# EAGLE design main_board (EAGLE 7.5.0)
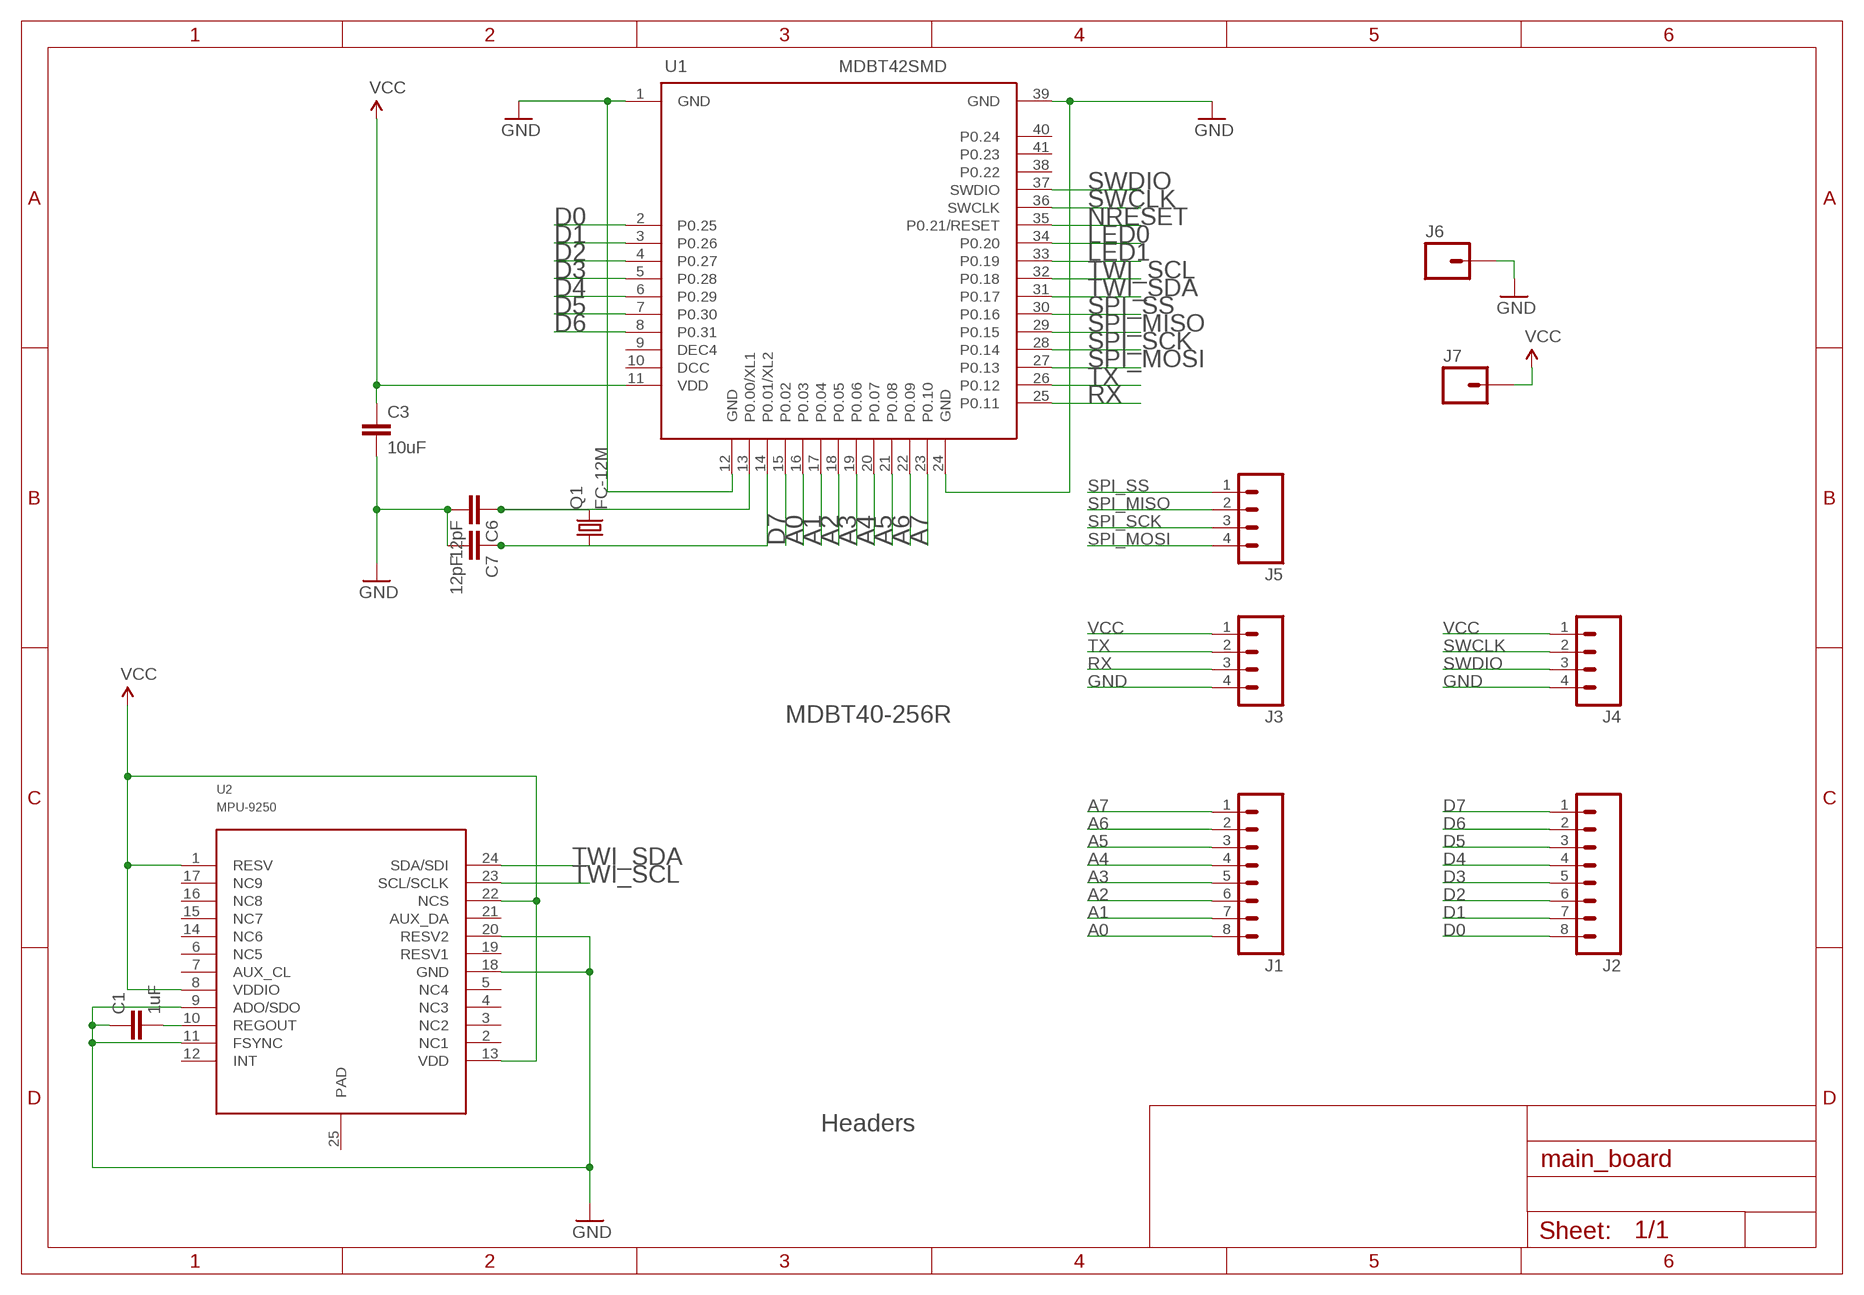
[diagram p0: schematic, sheet 1]

## Parts
C1  1uF  CAP0603-CAP  [0603-CAP]
C3  10uF  CAP0603-CAP  [0603-CAP]
C6  12pF  CAP0603-CAP  [0603-CAP]
C7  12pF  CAP0603-CAP  [0603-CAP]
J1  M08SILK_FEMALE_PTH  [1X08]
J2  M08SILK_FEMALE_PTH  [1X08]
J3  M04PTH  [1X04]
J4  M04PTH  [1X04]
J5  M04PTH  [1X04]
J6  M01_SMDSMD_4X2  [1X01_SMD]
J7  M01_SMDSMD_4X2  [1X01_SMD]
Q1  FC-12M  [FC-12M]
U1  MDBT42SMD  [MDBT42]
U2  MPU-9250  [LEAD-QFN24]

## Nets
A0: J1.8 U1.16(P0.03)
A1: J1.7 U1.17(P0.04)
A2: J1.6 U1.18(P0.05)
A3: J1.5 U1.19(P0.06)
A4: J1.4 U1.20(P0.07)
A5: J1.3 U1.21(P0.08)
A6: J1.2 U1.22(P0.09)
A7: J1.1 U1.23(P0.10)
D0: J2.8 U1.2(P0.25)
D1: J2.7 U1.3(P0.26)
D2: J2.6 U1.4(P0.27)
D3: J2.5 U1.5(P0.28)
D4: J2.4 U1.6(P0.29)
D5: J2.3 U1.7(P0.30)
D6: J2.2 U1.8(P0.31)
D7: J2.1 U1.15(P0.02)
GND: C1.1 C3.2 C6.2 C7.2 J3.4 J4.4 J6.P$1 U1.1(GND) U1.12(GND) U1.24(GND) U1.39(GND) U2.9(ADO/SDO) U2.11(FSYNC) U2.18(GND) U2.20(RESV2)
LED0: U1.34(P0.20)
LED1: U1.33(P0.19)
N$2: C7.1 Q1.1 U1.14(P0.01/XL2)
N$3: C6.1 Q1.2 U1.13(P0.00/XL1)
N$5: C1.2 U2.10(REGOUT)
NRESET: U1.35(P0.21/RESET)
RX: J3.3 U1.25(P0.11)
SPI_MISO: J5.2 U1.29(P0.15)
SPI_MOSI: J5.4 U1.27(P0.13)
SPI_SCK: J5.3 U1.28(P0.14)
SPI_SS: J5.1 U1.30(P0.16)
SWCLK: J4.2 U1.36(SWCLK)
SWDIO: J4.3 U1.37(SWDIO)
TWI_SCL: U1.32(P0.18) U2.23(SCL/SCLK)
TWI_SDA: U1.31(P0.17) U2.24(SDA/SDI)
TX: J3.2 U1.26(P0.12)
VCC: C3.1 J3.1 J4.1 J7.P$1 U1.11(VDD) U2.1(RESV) U2.8(VDDIO) U2.13(VDD) U2.22(NCS)
Unconnected: U1.9(DEC4) U1.10(DCC) U1.38(P0.22) U1.40(P0.24) U1.41(P0.23) U2.2(NC1) U2.3(NC2) U2.4(NC3) U2.5(NC4) U2.6(NC5) U2.7(AUX_CL) U2.12(INT) U2.14(NC6) U2.15(NC7) U2.16(NC8) U2.17(NC9) U2.19(RESV1) U2.21(AUX_DA) U2.25(PAD)

## Notes on the sheet
- MDBT40-256R
- Headers

## Library data of the parts
C1 C3 C6 C7 = SparkFun-Capacitors:CAP: Capacitor Standard 0603 ceramic capacitor, and 0.1" leaded capacitor.
J1 J2 = SparkFun-Connectors_2:M08: Header 8 Standard 8-pin 0.1" header. Use with straight break away headers (SKU : PRT-00116), right angle break away headers (PRT-00553), swiss pins (PRT-00743), machine pins (PRT-00117), and female headers (PRT-00115).; PROD_ID: CONN-08438
J3-J5 = SparkFun-Connectors_2:M04: Header 4 Standard 4-pin 0.1" header. Use with straight break away headers (SKU : PRT-00116), right angle break away headers (PRT-00553), swiss pins (PRT-00743), machine pins (PRT-00117), and female headers (PRT-00115). Molex polarized connector foot print use with SKU : PRT-08231 with associated crimp pins and housings. 1MM SMD Version SKU: PRT-10208; PROD_ID: CONN-09696
J6 J7 = SparkFun-Connectors 2:M01_SMD: Header 1 Standard 1-pin 0.1" header. Use with straight break away headers (SKU : PRT-00116), right angle break away headers (PRT-00553), swiss pins (PRT-00743), machine pins (PRT-00117), and female headers (PRT-00115). SMTSO-256-ET is a "flush mount" nut for a 4-40 screw. The older package used to be too tight, and did not allow it to sit properly thru the drill hit. The latest (0.165DIA) fits nice and snug.
Q1 = crystal:FC-12M: kHz RANGE CRYSTAL UNIT LOW PROFILE SMD Source: Epson Toyocom FC-12M.pdf
U1 = MDBT42:MDBT42
U2 = invensense:MPU-9250

## Board
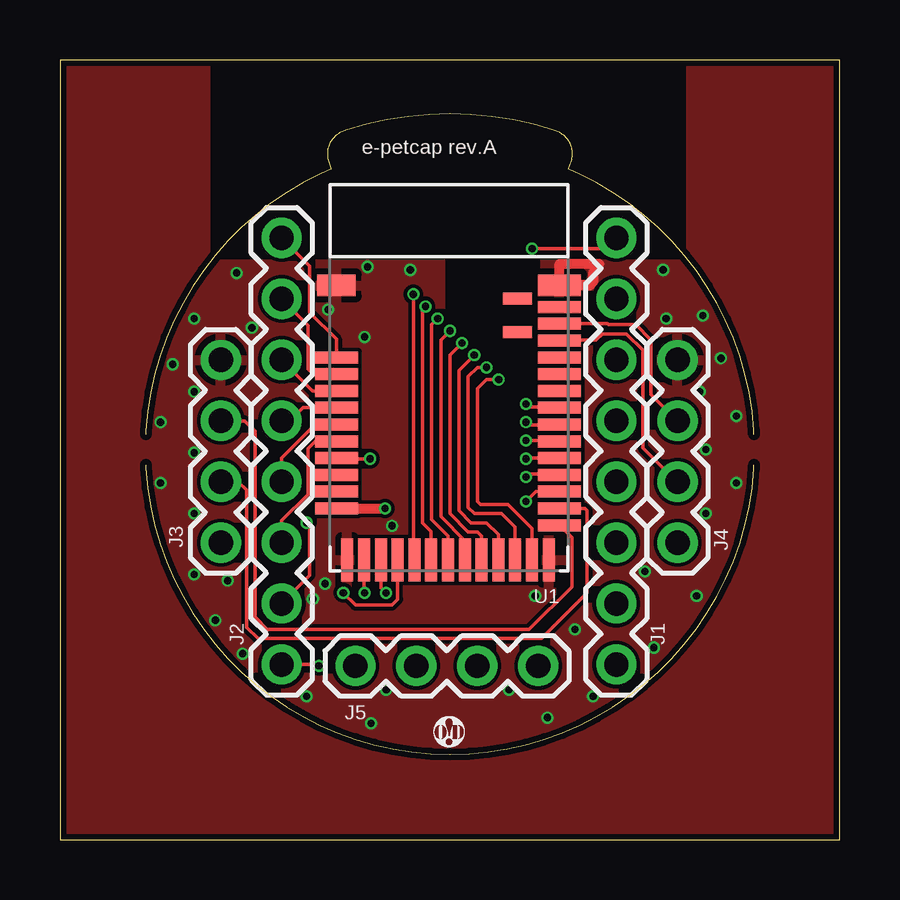
[diagram p1: board, top side]
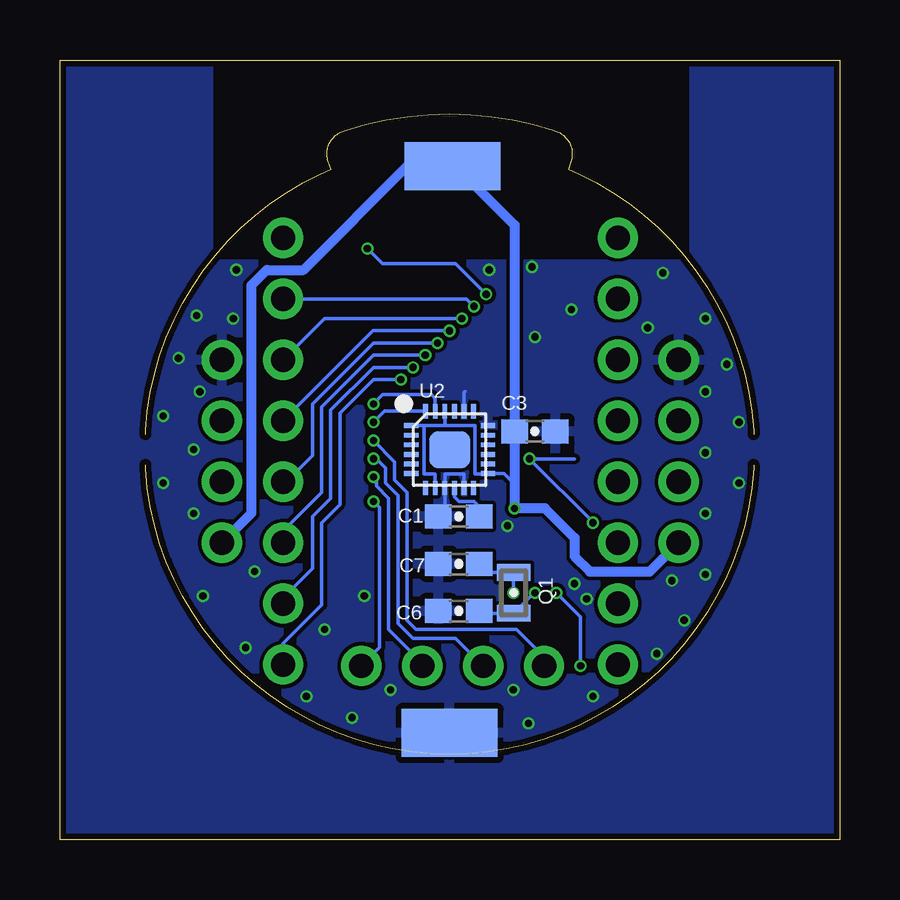
[diagram p2: board, bottom side, seen from below]

Size 32.5 x 32.5 mm. Coordinates in mm from the lower left corner, seen from the top.
Outline: 3.58,16.89 3.58,17.05 3.66,17.85 3.78,18.64 3.96,19.41 4.18,20.18 4.45,20.93 4.76,21.66 5.13,22.37 5.53,23.06 5.98,23.72 6.47,24.35 7,24.95 7.56,25.51 8.16,26.04 8.79,26.53 9.45,26.98 10.14,27.39 10.85,27.75 11.31,27.95 11.2,28.28 11.18,28.34 11.16,28.4 11.15,28.46 11.15,28.52 11.15,28.59 11.15,28.65 11.15,28.71 11.16,28.77 11.18,28.84 11.2,28.89 11.22,28.95 11.24,29.01 11.27,29.07 11.3,29.12 11.34,29.17 11.38,29.22 11.42,29.27 11.46,29.32 11.51,29.36 11.56,29.39 11.61,29.43 11.66,29.46 11.72,29.49 11.78,29.52 11.93,29.57 12.77,29.82 13.63,30.01 14.5,30.15 15.38,30.23 16.26,30.26 17.14,30.23 18.01,30.15 18.88,30.01 19.74,29.82 20.58,29.57 20.73,29.52 20.79,29.49 20.85,29.46 20.9,29.43 20.95,29.39 21,29.36 21.05,29.32 21.09,29.27 21.14,29.22 21.18,29.17 21.21,29.12 21.24,29.07 21.27,29.01 21.3,28.95 21.32,28.89 21.34,28.84 21.35,28.77 21.36,28.71 21.36,28.65 21.37,28.59 21.36,28.52 21.36,28.46 21.35,28.4 21.34,28.34 21.32,28.28 21.21,27.95 21.66,27.75 22.37,27.39 23.06,26.98 23.72,26.53 24.35,26.04 24.95,25.51 25.51,24.95 26.04,24.35 26.53,23.72 26.98,23.06 27.39,22.37 27.75,21.66 28.06,20.93 28.33,20.18 28.56,19.41 28.73,18.64 28.86,17.85 28.93,17.05 28.94,16.89
Outline: 28.94,15.62 28.93,15.46 28.86,14.66 28.73,13.88 28.56,13.1 28.33,12.33 28.06,11.58 27.75,10.85 27.39,10.14 26.98,9.45 26.53,8.79 26.04,8.16 25.51,7.56 24.95,7 24.35,6.47 23.72,5.98 23.06,5.53 22.37,5.13 21.66,4.76 20.93,4.45 20.18,4.18 19.41,3.96 18.64,3.78 17.85,3.66 17.05,3.58 16.26,3.56 15.46,3.58 14.66,3.66 13.88,3.78 13.1,3.96 12.33,4.18 11.58,4.45 10.85,4.76 10.14,5.13 9.45,5.53 8.79,5.98 8.16,6.47 7.56,7 7,7.56 6.47,8.16 5.98,8.79 5.53,9.45 5.13,10.14 4.76,10.85 4.45,11.58 4.18,12.33 3.96,13.1 3.78,13.88 3.66,14.66 3.58,15.46 3.58,15.62
Outline: 0,0 32.5,0 32.5,32.5 0,32.5 0,0
Copper layers (1*2*15*16): Top 0.035mm / dielectric 0.2mm / Route2 0.0175mm / dielectric 0.3mm / Route15 0.0175mm / dielectric 0.2mm / Bottom 0.035mm
Design rules "SeeedStudio_4layer_DRU_no_angle_20140221 *": minimum track width 6mil, minimum drill 0.29971875mm, track to track 6mil, track to pad 6mil, pad to pad 6mil, via to via 6mil, smd to smd 0mil, copper to edge 10mil, drill to drill 8mil, minimum pad ring 6mil, minimum via ring 4mil, stop-mask expansion 4mil, vias tented up to drill 25mil, thermal gap 10mil
tRestrict: area 6.3,20.2 to 26,32.5
bRestrict: area 6.3,24.3 to 26,32.5

### Footprints (pad centres in the part's own frame; a part is rotated, then mirrored left to right if it is on the bottom)
0603-CAP = smd 1.1 x 1: 1 -0.85,0; 2 0.85,0
1X08 = drill 1.016 pad 1.676: 1 0,0; 2 2.54,0; 3 5.08,0; 4 7.62,0; 5 10.16,0; 6 12.7,0; 7 15.24,0; 8 17.78,0
1X04 = drill 1.016 pad 1.676: 1 0,0; 2 2.54,0; 3 5.08,0; 4 7.62,0
1X01_SMD = smd 4 x 2: P$1 0,0
FC-12M = smd 0.7 x 1.4: 1 -0.85,0; 2 0.85,0
MDBT42 = smd 1.6 x 0.9: 1 0.35,11.8 | smd 1.8 x 0.5: 2 0.35,8.8; 3 0.35,8.1; 4 0.35,7.4; 5 0.35,6.7; 6 0.35,6; 7 0.35,5.3; 8 0.35,4.6; 9 0.35,3.9; 10 0.35,3.2; 11 0.35,2.5; 25 9.65,1.8; 26 9.65,2.5; 27 9.65,3.2; 28 9.65,3.9; 29 9.65,4.6; 30 9.65,5.3; 31 9.65,6; 32 9.65,6.7; 33 9.65,7.4; 34 9.65,8.1; 35 9.65,8.8; 36 9.65,9.5; 37 9.65,10.2; 38 9.65,10.9 | smd 0.5 x 1.8: 12 0.8,0.35; 13 1.5,0.35; 14 2.2,0.35; 15 2.9,0.35; 16 3.6,0.35; 17 4.3,0.35; 18 5,0.35; 19 5.7,0.35; 20 6.4,0.35; 21 7.1,0.35; 22 7.8,0.35; 23 8.5,0.35; 24 9.2,0.35 | smd 1.8 x 0.9: 39 9.65,11.8 | smd 1.2 x 0.5: 40 7.9,11.25; 41 7.9,9.85
LEAD-QFN24 = smd 0.6 x 0.2: 1 -1.6,1; 2 -1.6,0.6; 3 -1.6,0.2; 4 -1.6,-0.2; 5 -1.6,-0.6; 6 -1.6,-1; 13 1.6,-1; 14 1.6,-0.6; 15 1.6,-0.2; 16 1.6,0.2; 17 1.6,0.6; 18 1.6,1 | smd 0.2 x 0.6: 7 -1,-1.6; 8 -0.6,-1.6; 9 -0.2,-1.6; 10 0.2,-1.6; 11 0.6,-1.6; 12 1,-1.6; 19 1,1.6; 20 0.6,1.6; 21 0.2,1.6; 22 -0.2,1.6; 23 -0.6,1.6; 24 -1,1.6 | smd 1.7 x 1.54: 25 0,0

### Placement (x,y rotation side)
C1  15.88,13.46 0 bottom
C3  12.7,17.02 0 bottom
C6  15.88,9.53 180 bottom
C7  15.88,11.49 180 bottom
J1  23.2,7.3 90 top
J2  9.24,7.3 90 top
J3  6.71,12.37 90 top
J4  25.75,12.37 90 top
J5  12.32,7.24 0 top
J6  16.26,4.45 0 bottom
J7  16.13,28.07 0 bottom
Q1  13.59,10.29 270 bottom
U1  11.18,11.3 0 top
U2  16.26,16.26 0 bottom

### Tracks (layer width: path | path; a pad name or v marks a point on that pad's centre or on a via)
A0  (via drill 0.3)
  Top 0.152: v14.73,22.73 14.73,11.7 U1.16 | J1.8 22.76,24.64 v19.68,24.64
  Bottom 0.152: v14.73,22.73 16,24 19.05,24 v19.68,24.64
A1  (via drill 0.3)
  Top 0.152: v15.24,22.23 15.11,22.1 15.11,13.21 15.48,12.85 U1.17
  Bottom 0.152: v15.24,22.23 15.55,22.54 J1.7
A2  (via drill 0.3)
  Top 0.152: v15.75,21.72 15.49,21.46 15.49,13.34 16.18,12.65 U1.18
  Bottom 0.152: v15.75,21.72 21.48,21.72 J1.6
A3  (via drill 0.3)
  Top 0.152: v16.26,21.21 15.88,20.83 15.88,13.46 16.89,12.45 16.89,11.67 U1.19
  Bottom 0.152: v16.26,21.21 19.45,21.21 J1.5
A4  (via drill 0.3)
  Top 0.152: 17.53,11.7 U1.20 17.58,12.65 17.4,12.83 17.02,12.83 16.26,13.59 16.26,20.19 v16.76,20.7
  Bottom 0.152: v16.76,20.7 19.43,20.7 21.97,18.16 21.97,16 23.05,14.92 J1.4
A5  (via drill 0.3)
  Top 0.152: 18.29,11.66 U1.21 18.28,12.71 17.78,13.21 17.14,13.21 16.64,13.72 16.64,19.56 v17.27,20.19
  Bottom 0.152: v17.27,20.19 19.43,20.19 21.59,18.03 21.59,14.48 23.2,12.87 J1.3
A6  (via drill 0.3)
  Top 0.152: 18.92,11.71 U1.22 18.98,13.03 18.41,13.59 17.27,13.59 17.02,13.84 17.02,19.3 17.4,19.68 v17.78,19.68
  Bottom 0.152: v17.78,19.68 19.43,19.68 21.21,17.91 21.21,14.22 21.97,13.46 21.97,11.3 23.2,10.08 J1.2
A7  (via drill 0.3)
  Top 0.152: 19.56,11.77 U1.23 19.68,12.96 18.67,13.97 17.53,13.97 17.4,14.1 17.4,18.8 17.78,19.18 v18.29,19.18
  Bottom 0.152: v18.29,19.18 19.43,19.18 20.83,17.78 20.83,13.97 21.59,13.21 21.59,9.78 23.2,8.17 J1.1
D0
  Top 0.152: J2.8 10.41,23.91 10.41,21.97 11.53,20.86 U1.2
D1
  Top 0.152: J2.7 10.35,21.42 10.35,19.61 10.57,19.4 U1.3
D2
  Top 0.152: J2.6 10.54,18.7 U1.4
D3
  Top 0.152: J2.5 9.59,17.46 10.13,18 U1.5
D4
  Top 0.152: J2.4 9.24,15.9 10.6,17.27 11.49,17.27 U1.6
D5
  Top 0.152: J2.3 9.24,13.3 10.35,14.39 10.35,16.29 10.63,16.6 U1.7
D6  (via drill 0.3)
  Top 0.152: v12.93,15.88 11.53,15.88 U1.8 | J2.2 10.41,11.01 10.41,13.08 v10.29,13.21
  Bottom 0.152: 11.05,15.88 v12.93,15.88 10.29,13.23 v10.29,13.21
D7  (via drill 0.3)
  Top 0.152: J2.1 10.73,7.3 v10.79,7.24 | U1.15 14.08,10.01 13.84,9.78 12.32,9.78 v11.81,10.29
  Bottom 0.152: v10.79,7.24 10.79,9.27 v11.81,10.29
GND  (via drill 0.3)
  Top 0.406: U1.39 20.83,23.11 | 20.83,23.11 20.83,24 22.48,24 22.23,23.62 22.23,23.24 22.1,23.11 20.83,23.11
  Bottom 0.152: U2.11 15.66,15.24 16.46,15.24 U2.9 16.46,13.34 C1.1 | U2.20 15.66,18.63 15.62,18.67
  other vias: 10.29,5.97 7.62,7.75 6.48,9.14 5.59,11.05 6.99,10.79 5.59,13.59 5.59,16.13 5.59,18.67 5.59,21.72 7.37,23.62 8,21.34 12.7,20.95 12.83,23.88 11.18,22.1 14.61,23.75 25.27,21.72 25.15,23.75 26.8,21.84 28.19,17.65 26.92,16.26 26.92,13.59 26.54,10.16 28.19,14.86 26.67,18.67 4.7,19.81 4.19,17.4 4.19,14.86 27.56,20.07 20.32,5.08 19.81,10.16 10.54,10.03 11.05,10.67 22.23,5.97 21.46,8.76 13.6,6.24 18.72,6.24 12.97,4.84 24.77,8 24.38,11.18 13.84,13.08
  pour Top: 0,32.5 32.5,32.5 32.5,0 0,0
  pour Bottom: 0,32.5 32.5,32.5 32.5,0 0,0
N$2  (via drill 0.3)
  Top 0.152: U1.14 13.38,10.5 v13.59,10.29
  Bottom 0.152: v13.59,10.29 Q1.1 14.8,11.14 C7.1
N$3  (via drill 0.3)
  Top 0.152: U1.13 12.68,10.31 v12.7,10.29
  Bottom 0.152: v12.7,10.29 12.74,10.29 Q1.2 14.99,9.44 C6.1
N$5
  Bottom 0.152: U2.10 16.06,14.28 15.88,14.1 15.24,14.1 15.11,13.97 15.11,13.42 C1.2
RX
  Top 0.152: U1.25 21.34,12.59 21.34,10.54 19.56,8.76 8.64,8.76 8.14,9.28 8.14,17.03 7.69,17.45 J3.3
SPI_MISO  (via drill 0.3)
  Top 0.152: v19.43,15.88 19.46,15.9 U1.29
  Bottom 0.152: J5.2 16,8.38 17.78,8.38 18.41,9.02 18.41,14.35 18.92,14.86 18.92,15.49 19.3,15.88 v19.43,15.88
SPI_MOSI  (via drill 0.3)
  Top 0.152: U1.27 19.84,14.5 v19.43,14.1
  Bottom 0.152: 19.68,7.49 J5.4 19.18,8 19.18,13.84 v19.43,14.1
SPI_SCK  (via drill 0.3)
  Top 0.152: U1.28 20.79,15.24 19.56,15.24 v19.43,15.11
  Bottom 0.152: v19.43,15.11 19.3,14.99 19.3,14.73 18.8,14.22 18.8,8.76 17.4,7.37 J5.3
SPI_SS  (via drill 0.3)
  Top 0.152: U1.30 20.79,16.64 v19.43,16.64
  Bottom 0.152: v19.43,16.64 18.54,15.75 18.54,14.99 18.03,14.48 18.03,9.14 17.65,8.76 13.46,8.76 12.32,7.62 J5.1
SWCLK
  Top 0.152: J4.2 25.73,14.91 24.31,16.33 24.31,20.4 23.62,21.08 22.61,21.08 22.35,20.83 20.85,20.83 U1.36
SWDIO
  Top 0.152: J4.3 24.64,18.56 24.64,20.83 24,21.46 22.86,21.46 22.82,21.5 U1.37
TWI_SCL  (via drill 0.3)
  Top 0.152: U1.32 20.8,18.03 19.56,18.03 v19.43,18.16
  Bottom 0.152: v19.43,18.16 19.05,18.54 17.02,18.54 16.86,18.38 U2.23
TWI_SDA  (via drill 0.3)
  Top 0.152: U1.31 20.8,17.27 19.56,17.27 v19.43,17.4
  Bottom 0.152: v19.43,17.4 18.97,17.86 U2.24
TX
  Top 0.152: U1.26 21.88,13.8 21.97,13.72 21.97,10.29 20.07,8.38 8.26,8.38 7.79,8.85 7.79,14.57 7.44,14.91 J3.2
VCC  (via drill 0.3)
  Top 0.406: U1.11 11.56,13.77 11.59,13.8 v13.55,13.8
  Bottom 0.152: U2.22 16.46,17.26 | 16.46,17.26 17.32,17.26 | 17.32,17.26 U2.1 | U2.8 16.86,15.24 17.32,15.24 17.32,17.26 | 16.46,17.26 15.19,17.26 15.19,15.24 14.78,15.24 U2.13 13.99,15.26 13.55,14.82 C3.1
  Bottom 0.406: J3.1 7.91,11.18 10.41,11.18 11.05,11.81 11.05,12.57 12.28,13.8 v13.55,13.8 C3.1 13.55,25.61 16,28.07 J7.P$1 18.03,28.07 22.35,23.75 23.88,23.75 24.51,23.11 24.51,13.61 J4.1

### Text on the board
tPlace: e-petcap rev.A